# EAGLE design tandy_sound (EAGLE 9.5.2)
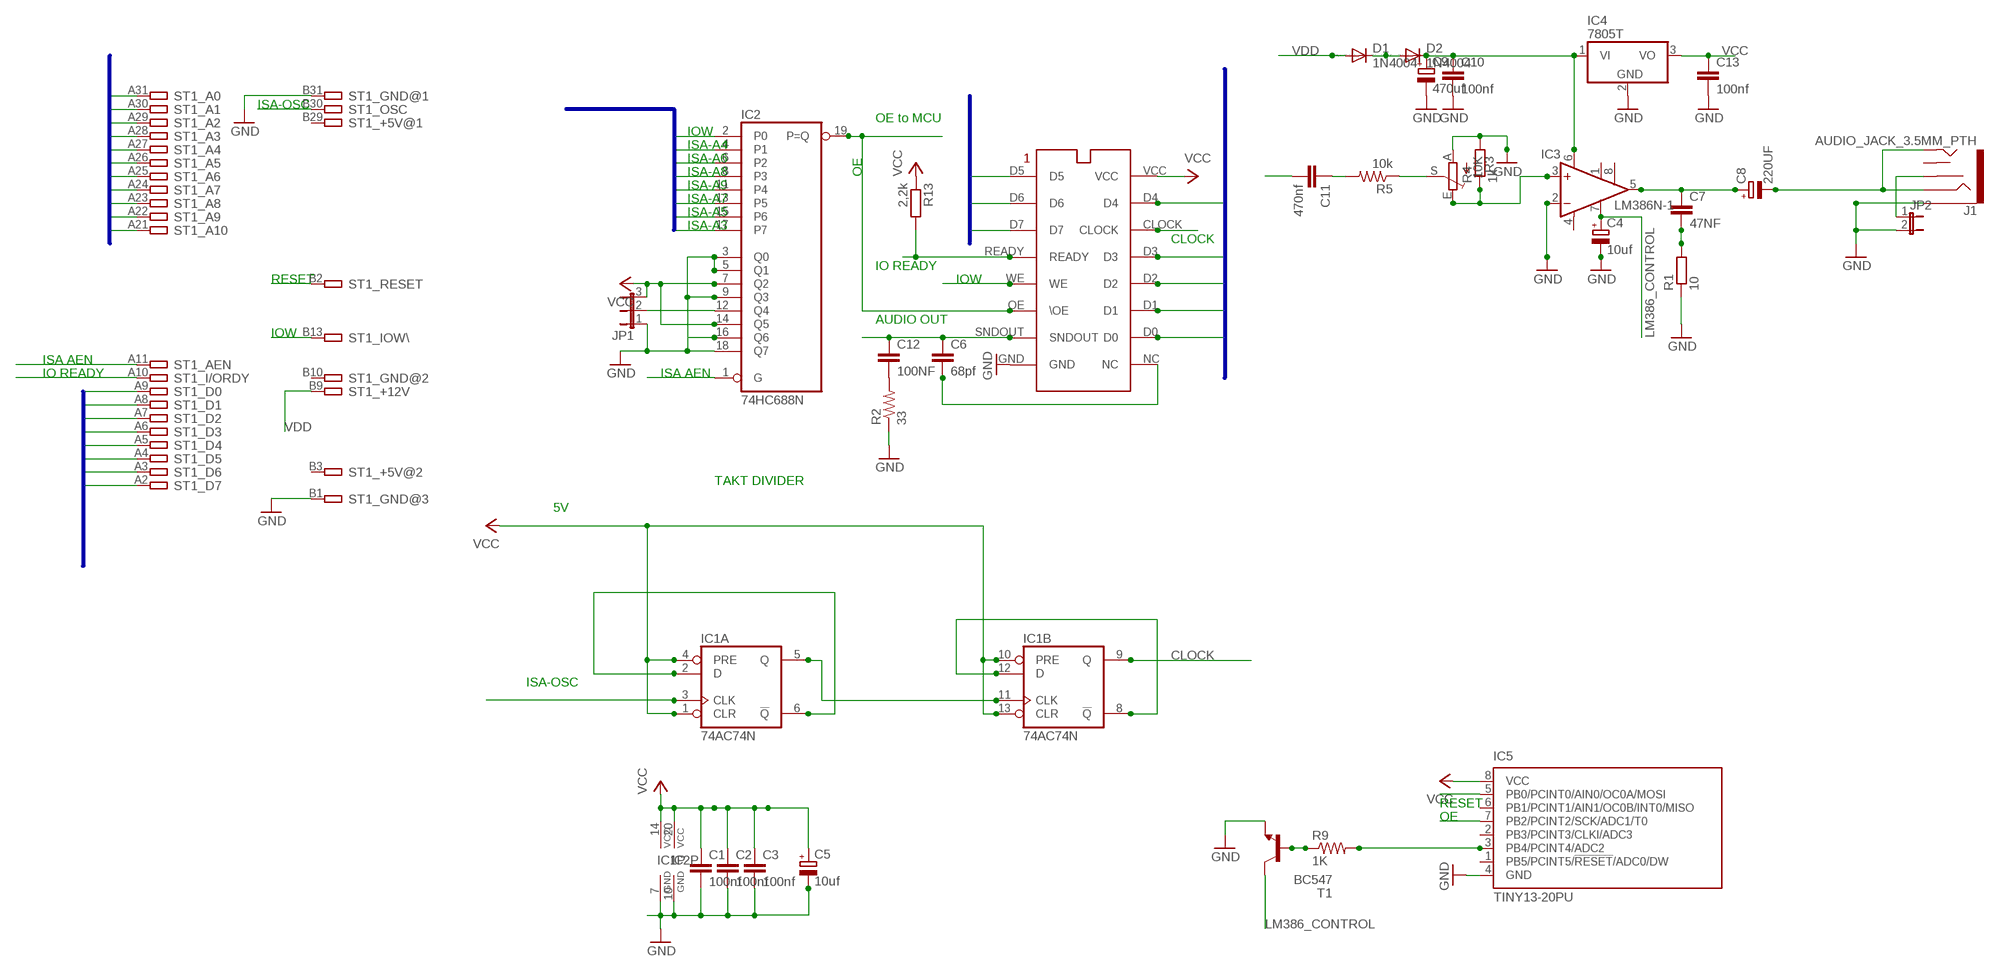
[diagram p0: schematic, sheet 1]

## Parts
C1  100nf  C2,5-3  [C2.5-3]
C2  100nf  C2,5-3  [C2.5-3]
C3  100nf  C2,5-3  [C2.5-3]
C4  10uf  CPOL-EUE2.5-6  [E2,5-6]
C5  10uf  CPOL-EUE2.5-6  [E2,5-6]
C6  68pf  C-EU025-030X050  [C025-030X050]
C7  47NF  C-EU025-030X050  [C025-030X050]
C8  220UF  CPOL-EUE2,5-6E  [E2,5-6E]
C9  470uf  CPOL-EUE2.5-6  [E2,5-6]
C10  100nf  C2,5-3  [C2.5-3]
C11  470nf  C-EU025-030X050  [C025-030X050]
C12  100NF  C-EU025-030X050  [C025-030X050]
C13  100nf  C2,5-3  [C2.5-3]
D1  1N4004  [DO41-10]
D2  1N4004  [DO41-10]
IC1  74AC74N  [DIL14]
IC2  74HC688N  [DIL20]
IC3  LM386N-1  [DIL08]
IC4  7805T  [TO220H]
IC5  TINY13-20PU  [DIL08]
J1  AUDIO_JACK_3.5MM_PTH  [AUDIO-JACK]
JP1  JP2E  [JP2]
JP2  JP1E  [JP1]
R1  10  R-EU_0207/10  [0207/10]
R2  33  R-US_0204/2V  [0204V]
R3  10K  TRIM_EU-PT10S  [PT-10S]
R4  1k  R-EU_0207/10  [0207/10]
R5  10k  R-US_0204/2V  [0204V]
R9  1K  R-US_0204/2V  [0204V]
R13  2,2k  R-EU_0207/10  [0207/10]
ST1  IBM8BIT  [IBM8BIT]
T1  BC547  [TO92]
U$1  SN76489  SN76489SN76489  [DIL16]

## Nets
A0: ST1.A31
A1: ST1.A30
A2: ST1.A29
A3: IC2.17(P7) ST1.A28
A4: IC2.4(P1) ST1.A27
A5: IC2.15(P6) ST1.A26
A6: IC2.6(P2) ST1.A25
A7: IC2.13(P5) ST1.A24
A8: IC2.8(P3) ST1.A23
A9: IC2.11(P4) ST1.A22
A10: ST1.A21
CLOCK: IC1.9(B:Q) U$1.CLOCK
CMS_CLOCK: IC1.5(A:Q) IC1.11(B:CLK)
D0: ST1.A9 U$1.D0
D1: ST1.A8 U$1.D1
D2: ST1.A7 U$1.D2
D3: ST1.A6 U$1.D3
D4: ST1.A5 U$1.D4
D5: ST1.A4 U$1.D5
D6: ST1.A3 U$1.D6
D7: ST1.A2 U$1.D7
GND: C1.2 C2.2 C3.2 C4.- C5.- C9.- C10.2 C13.2 IC1.7(P:GND) IC2.3(Q0) IC2.5(Q1) IC2.9(Q3) IC2.10(GND) IC2.16(Q6) IC2.18(Q7) IC3.2(-IN) IC4.2(GND) IC5.4(GND) J1.SLEEVE JP1.1 JP2.2 R1.1 R2.1 R3.A R4.2 ST1.B1 ST1.B31 T1.1(E) U$1.GND
IOW: IC2.2(P0) ST1.B13 U$1.WE
ISAAEN: IC2.1(G) ST1.A11
ISAOSC: IC1.3(A:CLK) ST1.B30
LM386_CONTROL: C4.+ IC3.7(BYPASS) T1.3(C)
N$1: C8.- J1.RING J1.TIP
N$2: IC1.2(A:D) IC1.6(A:!Q)
N$3: C6.2 U$1.NC
N$4: IC5.3(PB4/PCINT4/ADC2) R9.2
N$5: IC1.8(B:!Q) IC1.12(B:D)
N$6: C7.2 R1.2
N$7: D1.C D2.A
N$8: IC2.12(Q4) JP1.2
N$9: C7.1 C8.+ IC3.5(OUT)
N$10: C9.+ C10.1 D2.C IC3.6(VS) IC4.1(VI)
N$11: IC3.3(+IN) R3.E R4.1
N$12: R3.S R5.1
N$13: R9.1 T1.2(B)
N$14: C12.2 R2.2
N$15: C11.1 R5.2
N$16: J1.RSH JP2.1
OE: IC2.19(P=Q) IC5.7(PB2/PCINT2/SCK/ADC1/T0) U$1.OE(\OE)
READY: R13.2 ST1.A10 U$1.READY
RESET: IC5.5(PB0/PCINT0/AIN0/OC0A/MOSI) ST1.B2
SNDOUT: C6.1 C11.2 C12.1 U$1.SNDOUT
VCC: C1.1 C2.1 C3.1 C5.+ C13.1 IC1.1(A:CLR) IC1.4(A:PRE) IC1.10(B:PRE) IC1.13(B:CLR) IC1.14(P:VCC) IC2.7(Q2) IC2.14(Q5) IC2.20(VCC) IC4.3(VO) IC5.8(VCC) JP1.3 R13.1 U$1.VCC
VDD: D1.A ST1.B9
Unconnected: IC3.1(GAIN) IC3.8(GAIN) IC5.1(PB5/PCINT5/!RESET!/ADC0/DW) IC5.2(PB3/PCINT3/CLKI/ADC3) IC5.6(PB1/PCINT1/AIN1/OC0B/INT0/MISO) J1.TSH ST1.A1 ST1.A12 ST1.A13 ST1.A14 ST1.A15 ST1.A16 ST1.A17 ST1.A18 ST1.A19 ST1.A20 ST1.B3 ST1.B4 ST1.B5 ST1.B6 ST1.B7 ST1.B8 ST1.B10 ST1.B11 ST1.B12 ST1.B14 ST1.B15 ST1.B16 ST1.B17 ST1.B18 ST1.B19 ST1.B20 ST1.B21 ST1.B22 ST1.B23 ST1.B24 ST1.B25 ST1.B26 ST1.B27 ST1.B28 ST1.B29

## Buses
ISA,A0,A1,A2,A3,A4,A5,A6,A7,A8,A9,A10,IOW
DATA,D0,D1,D2,D3,D4,D5,D6,D7

## Notes on the sheet
- ISA-OSC
- OE to MCU
- IOW
- ISA-A4
- ISA-A6
- ISA-A8 | OE
- ISA-A9
- ISA-A7
- ISA-A5
- ISA-A3
- CLOCK
- IO READY
- RESET | IOW
- AUDIO OUT
- IOW
- ISA AEN
- IO READY | ISA AEN
- TAKT DIVIDER
- 5V
- ISA-OSC
- RESET
- OE

## Power pins joined to a net without a drawn wire
GND: IC3.4(GND)

## Library data of the parts
C1-C3 C10 C13 = capacitor-wima:C: CAPACITOR naming: grid - package width
C4 C5 C8 C9 = rcl:CPOL-EU: POLARIZED CAPACITOR, European symbol
C6 C7 C11 C12 = resistor:C-EU: CAPACITOR, European symbol
D1 D2 = diode:1N4004: DIODE general purpose rectifier, 1 A
IC1 = 74xx-eu:74*74: Dual D type positive edge triggered FLIP FLOP, preset and clear
IC2 = 74xx-eu:74*688: 8-bit MAGNITUDE/IDENTITY COMPARATOR, totem pole
IC3 = linear:LM386?-*: Low Voltage Audio Power Amplifier Source: http://cache.national.com/ds/LM/LM386.pdf
IC4 = linear:78*: Positive VOLTAGE REGULATOR Source: http://cache.national.com/ds/LM/LM78L05.pdf http://www.fairchildsemi.com/ds/LM/LM7805.pdf
IC5 = atmel:TINY13: 8-bit AVR Microcontroller with 1K Bytes In-System Programmable Flash Source: http://www.atmel.com/dyn/resources/prod_documents/2535S.pdf; MPN: ATTINY13-20PU; OC_FARNELL: 9171550; OC_NEWARK: 96K6521
J1 = SparkFun-Connectors:AUDIO_JACK_3.5MM: Audio Jack 3.5mm variants of PTH and SMT stereo audio jack with bypass switches. SparkFun Products: SparkFun SparkPunk Sound Kit <[https://www.sparkfun.com/products/11177]> - PTH MP3 Trigger <https://www.sparkfun.com/products/13720> -3.5mm SMD SparkFun PicoBoard <https://www.sparkfun.com/products/11888>- 2.5mm SMD; PROD_ID: CONN-08774; SF_ID: PRT-08032
JP1 = jumper:JP2E: JUMPER
JP2 = jumper:JP1E: JUMPER
R1 R4 R13 = resistor:R-EU_: RESISTOR, European symbol
R2 R5 R9 = rcl:R-US_: RESISTOR, American symbol
R3 = pot:TRIM_EU-: POTENTIOMETER
ST1 = con-pc:IBM8BIT: 8-bit CARD IBM/PC-AT
T1 = transistor:BC547: NPN TRANSISTOR
U$1 = SN76489:SN76489

## Board
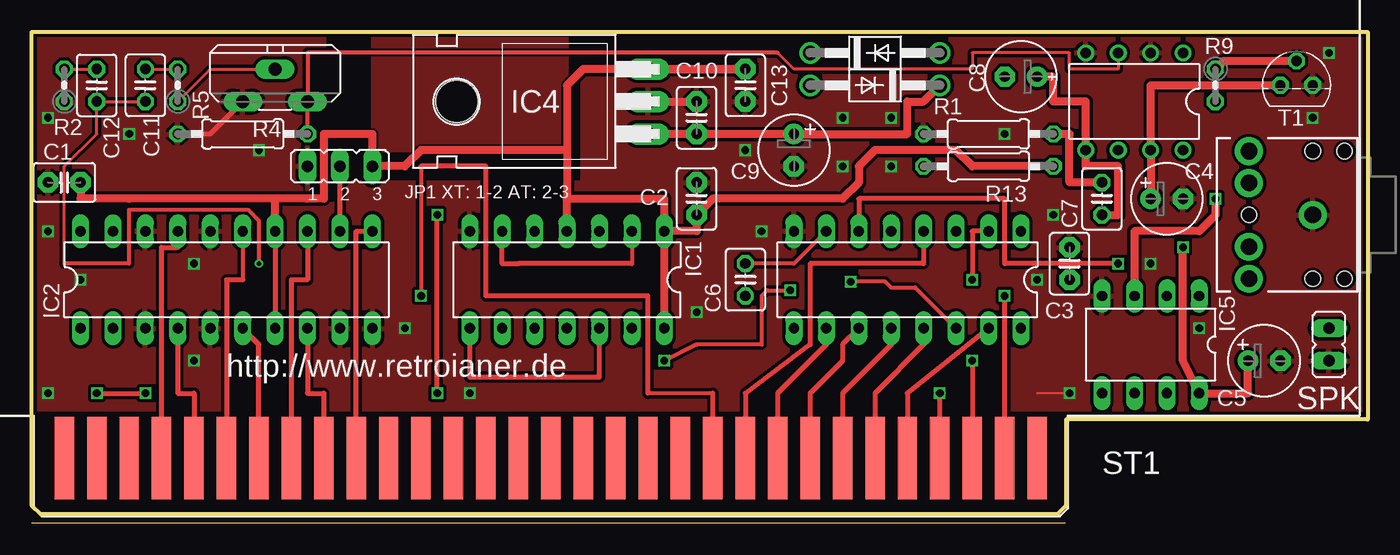
[diagram p1: board, top side]
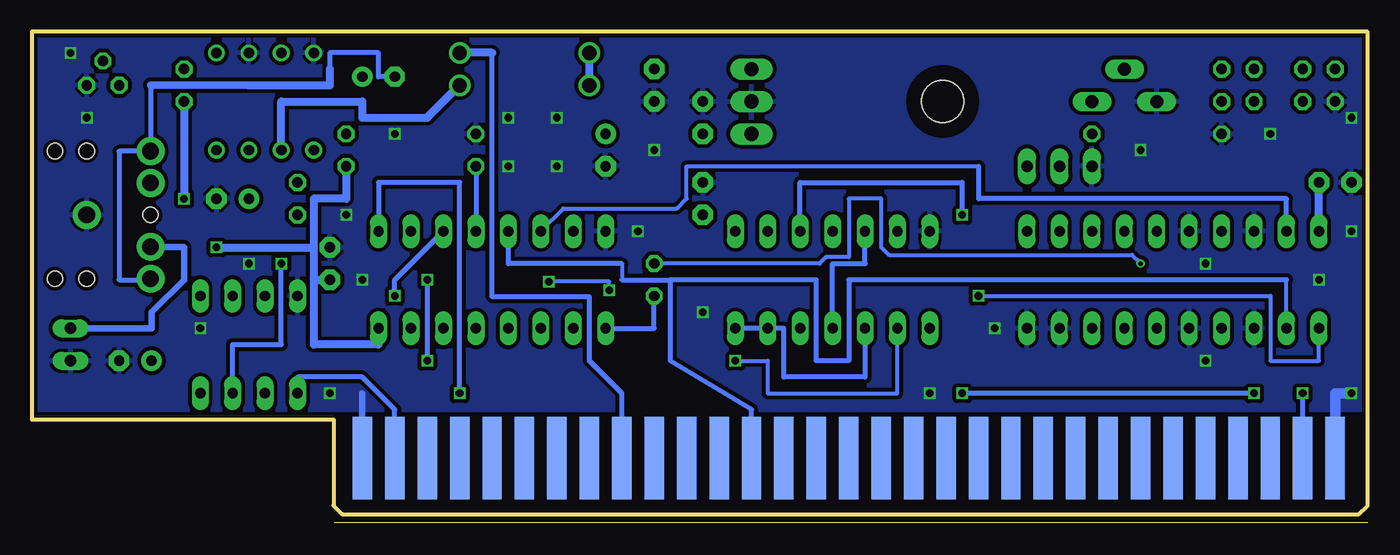
[diagram p2: board, bottom side, seen from below]

Size 104.62 x 38.48 mm. Coordinates in mm from the lower left corner, seen from the top.
Outline: 0,0 80.95,0
Outline: 0,1.35 0,38.48 104.62,38.48 104.62,8.1 81,8.1 81,1.35 80.33,0.68 0.68,0.68 0,1.35
Copper layers (1*16): Top 0.035mm / dielectric 1.5mm / Bottom 0.035mm
Design rules "dirt_cheap_dirty_boards.v1.1": minimum track width 6mil, minimum drill 12mil, track to track 6mil, track to pad 6mil, pad to pad 6mil, via to via 6mil, smd to smd 0mil, copper to edge 10mil, drill to drill 10mil, minimum pad ring 10mil, minimum via ring 6mil, stop-mask expansion 2mil, vias tented up to drill 25mil, thermal gap 10mil

### Footprints (pad centres in the part's own frame; a part is rotated, then mirrored left to right if it is on the bottom)
C2.5-3 = drill 0.813 pad 1.6 octagon: 1 -1.27,0; 2 1.27,0
E2,5-6 = drill 0.813 pad 1.6: + -1.27,0 | drill 0.813 pad 1.6 octagon: - 1.27,0
C025-030X050 = drill 0.813 octagon: 1 -1.27,0; 2 1.27,0
E2,5-6E = drill 0.813 pad 1.575: + -1.27,0 | drill 0.813 pad 1.575 octagon: - 1.27,0
DO41-10 = drill 1.118: A 5.08,0; C -5.08,0
DIL14 = drill 0.813 long: 1 -7.62,-3.81; 2 -5.08,-3.81; 3 -2.54,-3.81; 4 0,-3.81; 5 2.54,-3.81; 6 5.08,-3.81; 7 7.62,-3.81; 8 7.62,3.81; 9 5.08,3.81; 10 2.54,3.81; 11 0,3.81; 12 -2.54,3.81; 13 -5.08,3.81; 14 -7.62,3.81
DIL20 = drill 0.813 long: 1 -11.43,-3.81; 2 -8.89,-3.81; 3 -6.35,-3.81; 4 -3.81,-3.81; 5 -1.27,-3.81; 6 1.27,-3.81; 7 3.81,-3.81; 8 6.35,-3.81; 9 8.89,-3.81; 10 11.43,-3.81; 11 11.43,3.81; 12 8.89,3.81; 13 6.35,3.81; 14 3.81,3.81; 15 1.27,3.81; 16 -1.27,3.81; 17 -3.81,3.81; 18 -6.35,3.81; 19 -8.89,3.81; 20 -11.43,3.81
DIL08 = drill 0.813 pad 1.27: 1 -3.81,-3.81; 2 -1.27,-3.81; 3 1.27,-3.81; 4 3.81,-3.81; 5 3.81,3.81; 6 1.27,3.81; 7 -1.27,3.81; 8 -3.81,3.81
TO220H = drill 1.118 long: 1 -2.54,-10.16; 2 0,-10.16; 3 2.54,-10.16 | hole 3.302: 0,4.826
DIL08' = drill 0.813 long: 1 -3.81,-3.81; 2 -1.27,-3.81; 3 1.27,-3.81; 4 3.81,-3.81; 5 3.81,3.81; 6 1.27,3.81; 7 -1.27,3.81; 8 -3.81,3.81
AUDIO-JACK = drill 1.3 pad 2.184: RING 5,5; RSH 5,2.5; SLEEVE 0,0; TIP 5,-5; TSH 5,-2.5 | hole 1.2: 0,5; -2.5,5; -2.5,-5; 0,-5; 5,0
JP2 = drill 0.914 long: 1 -2.54,0; 2 0,0; 3 2.54,0
JP1 = drill 0.914 long: 1 0,-1.27; 2 0,1.27
0207/10 = drill 0.813 octagon: 1 -5.08,0; 2 5.08,0
0204V = drill 0.813 octagon: 1 -1.27,0; 2 1.27,0
PT-10S = drill 1.016 long: A -2.54,-1.27; E 2.54,-1.27; S 0,1.27
IBM8BIT = smd 1.524 x 6.477: A1 -25.4,5.08; A2 -27.94,5.08; A3 -30.48,5.08; A4 -33.02,5.08; A5 -35.56,5.08; A6 -38.1,5.08; A7 -40.64,5.08; A8 -43.18,5.08; A9 -45.72,5.08; A10 -48.26,5.08; A11 -50.8,5.08; A12 -53.34,5.08; A13 -55.88,5.08; A14 -58.42,5.08; A15 -60.96,5.08; A16 -63.5,5.08; A17 -66.04,5.08; A18 -68.58,5.08; A19 -71.12,5.08; A20 -73.66,5.08; A21 -76.2,5.08; A22 -78.74,5.08; A23 -81.28,5.08; A24 -83.82,5.08; A25 -86.36,5.08; A26 -88.9,5.08; A27 -91.44,5.08; A28 -93.98,5.08; A29 -96.52,5.08; A30 -99.06,5.08; A31 -101.6,5.08 | smd 1.524 x 6.477 bottom: B1 -25.4,5.08; B2 -27.94,5.08; B3 -30.48,5.08; B4 -33.02,5.08; B5 -35.56,5.08; B6 -38.1,5.08; B7 -40.64,5.08; B8 -43.18,5.08; B9 -45.72,5.08; B10 -48.26,5.08; B11 -50.8,5.08; B12 -53.34,5.08; B13 -55.88,5.08; B14 -58.42,5.08; B15 -60.96,5.08; B16 -63.5,5.08; B17 -66.04,5.08; B18 -68.58,5.08; B19 -71.12,5.08; B20 -73.66,5.08; B21 -76.2,5.08; B22 -78.74,5.08; B23 -81.28,5.08; B24 -83.82,5.08; B25 -86.36,5.08; B26 -88.9,5.08; B27 -91.44,5.08; B28 -93.98,5.08; B29 -96.52,5.08; B30 -99.06,5.08; B31 -101.6,5.08
TO92 = drill 0.813 octagon: 1 1.27,0; 2 0,1.905; 3 -1.27,0
DIL16 = drill 0.813 long: CLOCK -3.81,3.81; D0 6.35,3.81; D1 3.81,3.81; D2 1.27,3.81; D3 -1.27,3.81; D4 -6.35,3.81; D5 -8.89,-3.81; D6 -6.35,-3.81; D7 -3.81,-3.81; GND 8.89,-3.81; NC 8.89,3.81; OE 3.81,-3.81; READY -1.27,-3.81; SNDOUT 6.35,-3.81; VCC -8.89,3.81; WE 1.27,-3.81

### Placement (x,y rotation side)
C1  2.54,26.67 180 top
C2  52.07,25.4 90 top
C3  81.28,20.32 90 top
C4  88.9,25.4 0 top
C5  96.52,12.7 0 top
C6  55.88,19.05 270 top
C7  83.82,25.4 90 top
C8  77.47,34.97 180 top
C9  59.69,29.21 270 top
C10  52.07,31.75 90 top
C11  8.89,34.29 270 top
C12  5.08,34.29 90 top
C13  55.88,34.29 270 top
D1  66.04,36.83 0 top
D2  66.04,34.29 180 top
IC1  41.91,19.05 180 top
IC2  15.24,19.05 0 top
IC3  86.36,33.02 180 top
IC4  38.1,33.02 90 top
IC5  TINY13-20PU  [DIL08']  87.63,13.97 180 top
J1  100.33,24.13 180 top
JP1  24.13,27.94 0 top
JP2  101.6,13.97 180 top
R1  74.93,30.48 0 top
R2  2.54,34.29 90 top
R3  19.05,34.29 0 top
R4  16.51,30.48 180 top
R5  11.43,34.29 90 top
R9  92.71,34.29 270 top
R13  74.93,27.94 180 top
ST1  104.14,0 0 top
T1  99.06,34.29 0 top
U$1  68.58,19.05 180 top

### Tracks (layer width: path | path; a pad name or v marks a point on that pad's centre or on a via)
A3
  Top 0.406: ST1.A28 10.16,21.59 11.43,21.59 IC2.17
A4
  Top 0.406: IC2.4 11.43,10.16 12.7,10.16 ST1.A27
A5
  Top 0.305: IC2.15 16.51,19.05
  Top 0.406: 16.51,19.05 15.24,19.05 ST1.A26
A6
  Top 0.406: ST1.A25 17.78,13.97 IC2.6
A7
  Top 0.406: IC2.13 21.59,19.05 20.32,19.05 ST1.A24
A8
  Top 0.406: IC2.8 21.59,10.16 22.86,10.16 ST1.A23
A9
  Top 0.406: ST1.A22 25.4,22.86 IC2.11
CLOCK  (via drill 0.6)
  Top 0.305: U$1.CLOCK 69.17,18.45 67.27,18.45 66.83,18.9 v64.12,18.9 | v49.53,12.7 52.07,13.97 57.15,13.97 57.15,17.78 57.59,18.23 v59.4,18.23
  Bottom 0.305: v49.53,12.7 46.99,12.7 46.99,10.16 36.83,10.16 IC1.9 | v59.4,18.23 59.4,18.9 v64.12,18.9
CMS_CLOCK
  Bottom 0.406: IC1.11 41.91,20.32 39.37,20.32 IC1.5
D0
  Top 0.406: ST1.A9 58.42,10.16 62.23,13.97 U$1.D0
D1
  Top 0.406: U$1.D1 63.5,13.97 63.5,12.7 60.96,10.16 ST1.A8
D2
  Top 0.406: U$1.D2 67.31,13.97 63.5,10.16 ST1.A7
D3
  Top 0.406: U$1.D3 69.85,13.97 66.04,10.16 ST1.A6
D4
  Top 0.406: U$1.D4 68.58,10.16 ST1.A5
D5  (via drill 0.6)
  Top 0.406: ST1.A4 v71.12,10.16
  Bottom 0.406: v71.12,10.16 71.12,26.67 77.47,26.67 U$1.D5
D6  (via drill 0.6)
  Top 0.406: U$1.D6 73.66,22.86 v73.66,19.05 | v73.66,12.7 ST1.A3
  Bottom 0.406: v73.66,19.05 v73.66,12.7
D7  (via drill 0.6)
  Top 0.406: ST1.A2 v76.2,17.78
  Bottom 0.406: U$1.D7 76.2,19.05 v76.2,17.78
GND  (via drill 0.6)
  Top 0.152: v81.28,10.16 78.74,10.16
  Top 0.406: R3.A 13.97,30.48 R4.2
  Top 0.61: IC4.2 C10.2
  Bottom 0.508: ST1.B1 78.74,10.16
  Bottom 0.813: ST1.B31 2.54,10.16 v1.27,10.16
  other vias: 1.27,31.75 3.81,19.05 1.27,22.86 12.7,20.32 12.7,12.7 63.5,31.75 91.44,15.24 57.15,22.86 67.31,31.75 67.31,27.94 80.01,24.13 29.21,15.24 78.74,19.05 17.78,29.21 7.62,30.48 63.5,27.94 55.88,29.21 76.2,30.48 87.63,20.32 101.6,36.83 100.33,31.75 34.29,10.16 52.07,16.51
  pour Bottom (isolate 0.305): 0,38.1 104.14,38.1 104.14,8.89 0,8.89
  pour Top (isolate 0.254): 0,8.89 0,38.1 22.86,38.1 22.86,26.67 43.18,26.67 43.18,38.1 104.14,38.1 104.14,8.89
  pour Bottom (isolate 0.305): 0,38.1 104.14,38.1 104.14,8.89 0,8.89
HEAT
  pour Top: 26.67,38.1 26.67,29.21 41.91,29.21 41.91,38.1
IOW
  Bottom 0.305: IC2.2 6.35,19.05 | 58.42,20.32 58.42,19.05
  Bottom 0.406: ST1.B13 48.26,8.89 54.61,12.7 54.61,19.05 | 6.35,19.05 40.64,19.05 40.64,12.7 43.18,12.7 43.18,19.05 54.61,19.05 | U$1.WE 67.31,20.32 58.42,20.32 | 58.42,19.05 54.61,19.05
ISAAEN  (via drill 0.6)
  Top 0.305: 53.34,10.16 48.26,10.16 | 30.48,27.94 v30.48,17.78
  Top 0.406: ST1.A11 53.34,10.16 | 48.26,10.16 48.26,17.78 35.56,17.78 35.56,27.94 30.48,27.94
  Bottom 0.305: v30.48,17.78 7.62,17.78 7.62,12.7 3.81,12.7 IC2.1
ISAOSC  (via drill 0.6)
  Top 0.406: v5.08,10.16 v8.89,10.16 | v31.75,10.16 v31.75,24.13
  Bottom 0.406: IC1.3 44.45,26.67 31.75,26.67 v31.75,24.13 | ST1.B30 v5.08,10.16 | v8.89,10.16 v31.75,10.16
LM386_CONTROL
  Top 0.61: C4.+ IC3.7 87.63,34.29 T1.3
N$1
  Bottom 0.152: 95.25,19.05 J1.RING
  Bottom 0.406: C8.- 77.47,34.97 77.47,36.83 81.28,36.83 81.28,35.56 | 95.33,34.29 J1.TIP 97.79,29.13 97.79,19.05 95.25,19.05
  Bottom 0.6: 95.33,34.29 87.63,34.29
  Bottom 0.61: 87.63,34.29 81.28,34.29 81.28,35.56
N$2
  Top 0.305: IC1.2 46.99,20.32
  Top 0.406: 46.99,20.32 38.1,20.32 36.83,20.32 IC1.6
N$3
  Bottom 0.406: U$1.NC 55.88,15.24 C6.2
N$4  (via drill 0.6)
  Top 0.61: IC5.3 86.36,22.86 91.44,22.86 92.71,24.13 v92.71,25.4
  Bottom 0.61: R9.2 v92.71,25.4
N$5
  Top 0.406: IC1.8 34.29,11.43 44.45,11.43 IC1.12
N$6
  Top 0.61: C7.2 81.28,26.67 81.28,30.48 R1.2
N$7
  Bottom 0.61: D2.A D1.C
N$8
  Top 0.406: IC2.12 JP1.2
N$9
  Top 0.61: C7.1 85.09,24.13 85.09,27.94 82.55,27.94 IC3.5 82.55,33.02 80.01,33.02 80.01,34.97 C8.+
N$10
  Top 0.61: D2.C 69.85,33.02 68.58,33.02 68.58,30.48 C9.+ C10.1 IC4.1
  Bottom 0.61: IC3.6 85.09,33.02 78.74,33.02 78.74,31.75 73.66,31.75 D2.C
N$11
  Top 0.254: IC3.3 85.09,35.56 81.28,35.56 81.28,36.83 73.66,36.83 73.66,35.56 59.69,35.56 58.42,36.83
  Top 0.305: 58.42,36.83 21.59,36.83 R3.E R4.1
N$12
  Top 0.254: R5.1 13.97,35.56 R3.S
N$13
  Top 0.61: T1.2 93.34,36.2 R9.1
N$14
  Top 0.254: R2.2 C12.2
N$15
  Top 0.254: C11.1 R5.2
N$16
  Bottom 0.152: 92.75,21.63 92.71,21.59
  Bottom 0.508: J1.RSH 92.75,21.63 | 92.71,21.59 92.71,19.05 95.25,16.51 95.25,15.24 JP2.1
OE  (via drill 0.6)
  Top 0.406: v85.09,20.32 76.2,20.32 76.2,25.4 64.77,25.4 U$1.OE
  Bottom 0.305: U$1.OE 62.99,24.64 54.1,24.64 53.34,25.4 53.34,27.94 30.48,27.94
  Bottom 0.406: IC5.7 88.9,13.97 85.09,13.97 v85.09,20.32 | IC2.19 6.35,25.4 30.48,25.4 30.48,27.94
READY
  Top 0.406: U$1.READY 69.85,20.32 60.96,20.32 60.96,13.97 55.88,10.16 ST1.A10
  Bottom 0.406: R13.2 U$1.READY
RESET
  Bottom 0.406: 76.2,6.35 76.2,8.89 78.74,11.43 83.82,11.43 IC5.5
  Bottom 0.508: ST1.B2 76.2,6.35
SNDOUT  (via drill 0.35)
  Top 0.254: C11.2 C12.1 5.08,30.48 2.54,27.94 2.54,20.32
  Top 0.305: U$1.SNDOUT 59.69,20.32 C6.1 | v17.78,20.32 17.78,23.69 16.93,24.54 7.62,24.54 7.62,20.32 2.54,20.32
  Bottom 0.305: v17.78,20.32 18.46,21 37.51,21 38.1,21.59 38.1,25.4 40.64,25.4 40.64,20.83 42.42,20.83 42.93,20.32 C6.1
VCC  (via drill 0.6)
  Top 0.406: IC2.14 IC2.7
  Top 0.61: IC1.1 IC1.14 | v90.17,21.59 90.17,12.7 IC5.8 95.25,10.16 C5.+ | IC1.4 41.91,25.4 | 41.91,25.4 49.53,25.4 IC1.1 | IC1.1 52.07,22.86 C2.1 53.34,25.4 63.5,25.4 64.77,26.67 64.77,27.94 66.04,29.21 72.39,29.21 73.66,27.94 R13.1 | 19.05,25.4 21.59,25.4 22.86,25.4 22.86,30.48 26.67,30.48 JP1.3 29.21,27.94 30.48,29.21 41.91,29.21 | 19.05,25.4 7.62,25.4 3.81,25.4 C1.1 | IC2.14 19.05,25.4 | IC4.3 C13.1 43.18,35.56 41.91,34.29 41.91,29.21 | 41.91,29.21 41.91,25.4
  Bottom 0.406: IC1.14 IC1.13 45.72,15.24 45.72,11.43 39.37,11.43 IC1.10
  Bottom 0.61: IC2.20 C1.1 | R13.1 80.01,25.4 82.55,25.4 82.55,21.59 | 82.55,21.59 82.55,19.05 | 82.55,19.05 C3.1 | v90.17,21.59 82.55,21.59 | 82.55,19.05 82.55,13.97 77.47,13.97 U$1.VCC
VDD
  Bottom 0.406: ST1.B9 58.42,10.16 60.96,12.7 60.96,17.7 68.58,17.7 68.58,36.83
  Bottom 0.61: 68.58,36.83 D1.A

### Text on the board
tPlace: http://www.retroianer.de
tNames: JP1 XT: 1-2 AT: 2-3 | SPK
tStop: TNDY Nano | v1.1